# EAGLE design nrfModule (EAGLE 8.2.2)
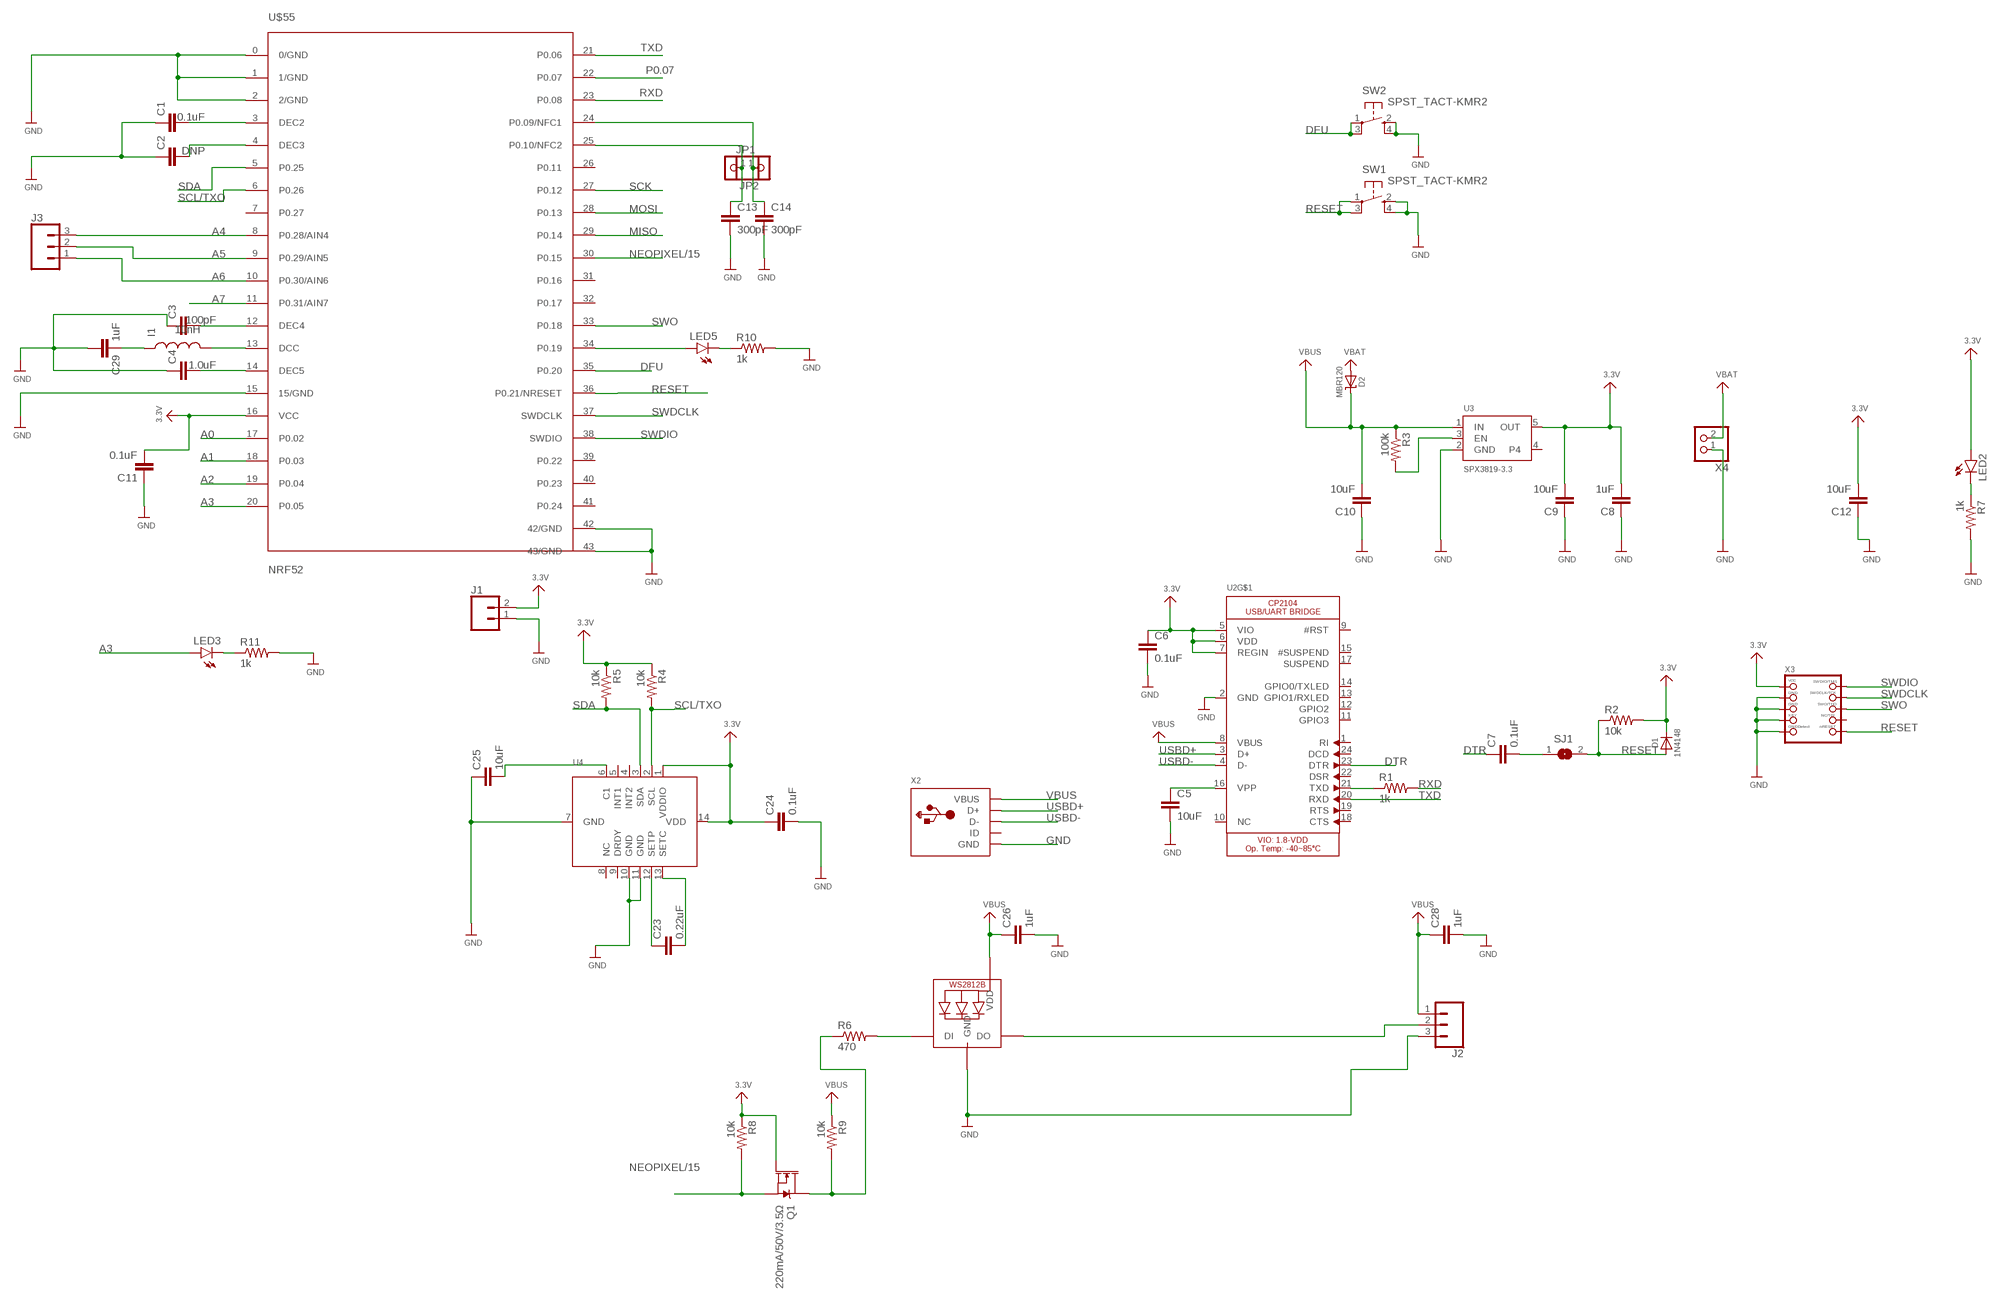
[diagram p0: schematic, sheet 1]

## Parts
C1  0.1uF  CAP  [0805]
C2  DNP  CAP  [0805]
C3  100pF  CAP  [0805]
C4  1.0uF  CAP  [0805]
C5  10uF  CAP  [0805]
C6  0.1uF  CAP  [0805]
C7  0.1uF  CAP  [0805]
C8  1uF  CAP  [0805]
C9  10uF  CAP  [0805]
C10  10uF  CAP  [0805]
C11  0.1uF  CAP  [0805]
C12  10uF  CAP  [0805]
C13  300pF  CAP  [0805]
C14  300pF  CAP  [0805]
C23  0.22uF  CAP  [0805]
C24  0.1uF  CAP  [0805]
C25  10uF  CAP  [0805]
C26  1uF  CAP  [0805]
C28  1uF  CAP  [0805]
C29  1uF  CAP  [0805]
D1  1N4148  DIODESOD-323  [SOD-323]
D2  MBR120  DIODE-SCHOTTKYSOD-123  [SOD-123]
I1  10nH  IND  [0805]
J1  CONN_02  [1X02]
J2  CONN_03  [1X03]
J3  CONN_03  [1X03]
JP1  HEADER-1X12MM  [1X01_2MM]
JP2  HEADER-1X12MM  [1X01_2MM]
LED1  WS2812B5050  [WS2812B]
LED2  LED0603  [LED-0603]
LED3  LED0603  [LED-0603]
LED5  LED0603  [LED-0603]
Q1  220mA/50V/3.5Ω  MOSFET-NCH-BSS138  [SOT23-3]
R1  1k  RES  [0805]
R2  10k  RES  [0805]
R3  100k  RES  [0805]
R4  10k  RES  [0805]
R5  10k  RES  [0805]
R6  470  RES  [0805]
R7  1k  RES  [0805]
R8  10k  RES  [0805]
R9  10k  RES  [0805]
R10  1k  RES  [0805]
R11  1k  RES  [0805]
SJ1  SOLDERJUMPERCLOSED  [SOLDERJUMPER_CLOSEDWIRE]
SW1  SPST_TACT-KMR2  [KMR2]
SW2  SPST_TACT-KMR2  [KMR2]
U2  CP2104  [QFN24_4MM_SMSC]
U3  SPX3819-3.3  VREG_SOT23-5  [SOT23-5]
U4  LSM303DLHC  [LGA14]
U$55  NRF52  [NRF52]
X2  USB_MICRO_20329_V2  [4UCONN_20329_V2]
X3  JTAG-CORTEX  [2X05_1.27MM_SMT]
X4  CON_JST_PH_2PIN  [JSTPH2]

## Nets
3.3V: C6.1 C8.2 C9.2 C11.2 C12.2 C24.1 D1.C J1.2 LED2.A Q1.1(G) R2.2 R4.1 R5.1 R8.1 U2.5(VIO) U2.6(VDD) U2.7(REGIN) U3.5(OUT) U4.1(VDDIO) U4.14(VDD) U$55.16(VCC) X3.1(VCC)
A0: U$55.17(P0.02)
A1: U$55.18(P0.03)
A2: U$55.19(P0.04)
A3: LED3.A U$55.20(P0.05)
A4: J3.3 U$55.8(P0.28/AIN4)
A5: J3.2 U$55.9(P0.29/AIN5)
A6: J3.1 U$55.10(P0.30/AIN6)
A7: U$55.11(P0.31/AIN7)
DFU: SW2.1(P) SW2.3(P1) U$55.35(P0.20)
DTR: C7.1 U2.23(DTR)
GND: C1.1 C2.1 C3.1 C4.1 C5.2 C6.2 C8.1 C9.1 C10.1 C11.1 C12.1 C13.2 C14.2 C24.2 C25.1 C26.2 C28.2 C29.2 J1.1 J2.3 LED1.3-GND(GND) R7.2 R10.2 R11.2 SW1.2(S) SW1.4(S1) SW2.2(S) SW2.4(S1) U2.2(GND) U3.2(GND) U4.7(GND) U4.10(GND) U4.11(GND) U$55.0(0/GND) U$55.1(1/GND) U$55.2(2/GND) U$55.15(15/GND) U$55.42(42/GND) U$55.43(43/GND) X2.BASE@1(GND) X2.BASE@2(GND) X2.GND X2.SPRT@1(GND) X2.SPRT@2(GND) X2.SPRT@3(GND) X2.SPRT@4(GND) X3.3(GND) X3.5(GND) X3.7(KEY) X3.9(GNDDETECT) X4.1
MISO: U$55.29(P0.14)
MOSI: U$55.28(P0.13)
N$1: LED5.A U$55.34(P0.19)
N$2: LED5.C R10.1
N$3: C2.2 U$55.4(DEC3)
N$4: C4.2 U$55.14(DEC5)
N$5: R1.1 U2.21(TXD)
N$6: C1.2 U$55.3(DEC2)
N$8: C5.1 U2.16(VPP)
N$9: C23.2 U4.13(SETC)
N$10: C13.1 JP2.1 U$55.25(P0.10/NFC2)
N$11: C7.2 SJ1.1
N$12: C23.1 U4.12(SETP)
N$13: R3.2 U3.3(EN)
N$14: C14.1 JP1.1 U$55.24(P0.09/NFC1)
N$15: LED2.C R7.1
N$16: LED3.C R11.1
N$20: Q1.3(D) R6.1 R9.2
N$21: C25.2 U4.6(C1)
N$23: J2.2 LED1.2-DOUT(DO)
N$25: LED1.4-DIN(DI) R6.2
N$26: I1.2 U$55.13(DCC)
N$27: C29.1 I1.1
N$28: C3.2 U$55.12(DEC4)
NEOPIXEL/15: Q1.2(S) R8.2 U$55.30(P0.15)
P0.07: U$55.22(P0.07)
RESET: D1.A R2.1 SJ1.2 SW1.1(P) SW1.3(P1) U$55.36(P0.21/NRESET) X3.10(NRESET)
RXD: R1.2 U$55.23(P0.08)
SCK: U$55.27(P0.12)
SCL/TXO: R4.2 U4.2(SCL) U$55.6(P0.26)
SDA: R5.2 U4.3(SDA) U$55.5(P0.25)
SWDCLK: U$55.37(SWDCLK) X3.4(SWDCLK)
SWDIO: U$55.38(SWDIO) X3.2(SWDIO)
SWO: U$55.33(P0.18) X3.6(SWO)
TXD: U2.20(RXD) U$55.21(P0.06)
USBD+: U2.3(D+) X2.D+
USBD-: U2.4(D-) X2.D-
VBAT: D2.A X4.2
VBUS: C10.2 C26.1 C28.1 D2.C J2.1 LED1.1-VDD(VDD) R3.1 R9.1 U2.8(VBUS) U3.1(IN) X2.VBUS
Unconnected: U2.1(RI) U2.9(#RST) U2.10(NC) U2.11(GPIO3) U2.12(GPIO2) U2.13(GPIO1/RXLED) U2.14(GPIO0/TXLED) U2.15(#SUSPEND) U2.17(SUSPEND) U2.18(CTS) U2.19(RTS) U2.22(DSR) U2.24(DCD) U3.4 U4.4(INT2) U4.5(INT1) U4.8(NC) U4.9(DRDY) U$55.7(P0.27) U$55.26(P0.11) U$55.31(P0.16) U$55.32(P0.17) U$55.39(P0.22) U$55.40(P0.23) U$55.41(P0.24) X2.ID X3.8(TDI)

## Power pins joined to a net without a drawn wire
TP: U2.THERM(TP)

## Library data of the parts
C1-C14 C23-C26 C28 C29 = Ilya_Teach:CAP
D1 = microbuilder:DIODE: Diode SMA Model Volts Amps Type Vf Ir Digikey # Notes SSA34-E3 40V 3A Schottky 480mV @ 3A 200uA @ 40V SSA34-E3/61TGITR-ND CDBA120-G 20V 1A Schottky 500mV @ 1A 500uA @ 20V 641-1014-6-ND REEL MBRA210 10V 2A Schottky 350mV @ 2A 700uA @ 10V MBRA210LT3 SOD-123 Model Volts Amps Type Vf Ir Order # Notes BAT54T1G 30V 200mA Schottky 800mV @ 200mA 2uA @ 25V BAT54T1GOSTR-ND B0530W 30V 500mA Schottky 430mV @ 500mA 130uA @ 30V B0530W-FDICT-ND REEL MBR120 20V 1A Schottky 340mV @ 1A MBR120VLSFT1GOSCT-ND SOD-323 Model Volts Amps Type Vf Ir Order # Notes PMEG2005EJ 20V 500mA Schottky 355mV @ 500mA 568-4110-1-ND ZLLS410 10V 570mA Schottky 380mV @ 570mA ZLLS410CT-ND 1N4148WS 75V 150mA Silicon/Simple 1V 1N4148WSFSCT-ND REEL SOD-523 Model Volts Amps Type Vf Ir Order # Notes BAT54XV2 30V 200mA Schottky 0.8V @ 100mA BAT54XV2CT-ND TB751S 30V 30mA Schottky RB751S-40TE61CT-ND SOT23-R/W (R = Solder Paste/Reflow Ovens, W = Hand-Soldering) Model Volts Amps Type Vf Ir Order # Notes BAT54FILM 40V 300mA Schottky 497-7162-1-ND POWERDI-5 Model Volts Amps Type Vf Ir Order # Notes PDS560 60V 5A Schottky 670mV @ 5A 150uA @ 60V PDS560DICT-ND
D2 = microbuilder:DIODE-SCHOTTKY
I1 = Ilya_Teach:IND
J1 = SparkFun-Connectors:CONN_02: Multi connection point. Often used as Generic Header-pin footprint for 0.1 inch spaced/style header connections On any of the 0.1 inch spaced packages, you can populate with these: Break Away Headers - Straight <https://www.sparkfun.com/products/116> (PRT-00116) Break Away Male Headers - Right Angle <https://www.sparkfun.com/products/553> (PRT-00553) Female Headers <https://www.sparkfun.com/products/115> (PRT-00115) Break Away Headers - Machine Pin <https://www.sparkfun.com/products/117> (PRT-00117) Break Away Female Headers - Swiss Machine Pin <https://www.sparkfun.com/products/743> (PRT-00743) For SCREWTERMINALS and SPRING TERMINALS visit here: Screw Terimnals on SparkFun.com <https://www.sparkfun.com/search/results?term=Screw+Terminals> (5mm/3.5mm/2.54mm spacing) This device is also useful as a general connection point to wire up your design to another part of your project. Our various solder wires solder well into these plated through hole pads. Hook-Up Wire - Assortment (Stranded, 22 AWG) <https://www.sparkfun.com/products/11375> (PRT-11375) Hook-Up Wire - Assortment (Solid Core, 22 AWG) <https://www.sparkfun.com/products/11367> (PRT-11367) View the entire wire category on our website here <https://www.sparkfun.com/categories/141> Special notes: Molex polarized connector foot print use with: PRT-08233 with associated crimp pins and housings. 2.54_SCREWTERM for use with PRT-10571. 3.5mm Screw Terminal footprints for PRT-08084 5mm Screw Terminal footprints for use with PRT-08432
J2 J3 = SparkFun-Connectors:CONN_03: Multi connection point. Often used as Generic Header-pin footprint for 0.1 inch spaced/style header connections On any of the 0.1 inch spaced packages, you can populate with these: Break Away Headers - Straight <https://www.sparkfun.com/products/116> (PRT-00116) Break Away Male Headers - Right Angle <https://www.sparkfun.com/products/553> (PRT-00553) Female Headers <https://www.sparkfun.com/products/115> (PRT-00115) Break Away Headers - Machine Pin <https://www.sparkfun.com/products/117> (PRT-00117) Break Away Female Headers - Swiss Machine Pin <https://www.sparkfun.com/products/743> (PRT-00743) Stackable Header - 3 Pin (Female, 0.1") <https://www.sparkfun.com/products/13875> (PRT-13875) For SCREWTERMINALS and SPRING TERMINALS visit here: Screw Terimnals on SparkFun.com <https://www.sparkfun.com/search/results?term=Screw+Terminals> (5mm/3.5mm/2.54mm spacing) This device is also useful as a general connection point to wire up your design to another part of your project. Our various solder wires solder well into these plated through hole pads. Hook-Up Wire - Assortment (Stranded, 22 AWG) <https://www.sparkfun.com/products/11375> (PRT-11375) Hook-Up Wire - Assortment (Solid Core, 22 AWG) <https://www.sparkfun.com/products/11367> (PRT-11367) View the entire wire category on our website here <https://www.sparkfun.com/categories/141> Special notes: Molex polarized connector foot print use with SKU : PRT-08232 with associated crimp pins and housings.
JP1 JP2 = microbuilder:HEADER-1X1: PIN HEADER
LED1 = adafruit:WS2812B
LED2 LED3 LED5 = Ilya_Teach:LED: LEDs Standard schematic elements and footprints for 5mm, 3mm, 1206, and 0603 sized LEDs. 5mm - Spark Fun Electronics SKU : COM-00529 (and others)
Q1 = SparkFun-DiscreteSemi:MOSFET-NCH: N-channel MOSFETs Voltage controlled devices that allow control of high current outputs. SparkFun Products: SparkFun OpenScale <https://www.sparkfun.com/products/13261> SparkFun Digital Sandbox <https://www.sparkfun.com/products/12651> SparkFun Monster Moto Shield <https://www.sparkfun.com/products/10182> SparkFun MOSFET Power Controller <https://www.sparkfun.com/products/11214>; PROD_ID: TRANS-00830
R1-R11 = Ilya_Teach:RES
SJ1 = microbuilder:SOLDERJUMPER: SMD Solder JUMPER Solder the two pads together to create a connection, or remove the solder to break it. REFLOW - Use this footprint for solder paste and reflow ovens. WAVE - Use this footprint for hand-soldering (larger pads). CLOSED - Has a trace between the two pads to ensure it is closed by default. The trace needs to be cut to disable the jumper, and can be closed again by creating a solder bridge between the two pads.
SW1 SW2 = adafruit:SPST_TACT: SMT 6mm switch, EVQQ2 series http://www.ladyada.net/library/eagle
U2 = microbuilder:CP2104: CP2104 - USB to UART Bridge VDD Output: 3.45V
U3 = microbuilder:VREG_SOT23-5: SOT23-5 Fixed Voltage Regulators Part Current Out V Out V In V Dropout ?JA (°C/W) TJ (°C) Digikey Part No. ADP121 150mA 3.3V 3.4-5.5V 0.09V @ 150mA -- -- ADP121-AUJZ33R7CT-ND ADP121 150mA 3.0V 3.1-5.5V 0.09V @ 150mA -- -- ADP121-AUJZ30R7CT-ND ADP122 300mA 3.3V 3.4-5.5V 0.085V @ 300mA -- -- ADP122AUJZ-3.3-R7CT-ND ADP1712 300mA 3.3V 3.5-5.5V 0.17V @ 300mA -- -- ADP1712AUJZ-3.3-R7TR-ND AP7311 (Low Cost) 150mA 3.3V 3.5-6V 0.15V @ 150mA -- -- AP7311-33WG-7DICT-ND LD39015M18R 150mA 1.8V 1.9V-5.5V 0.08V @ 100mA -- -- 497-6977-1-ND LP2985A-33DBVR 150mA 3.3V 3.3-16V 0.28V @ 150mA 206 150 296-18479-1-ND MCP1824T-3302E/OT 300mA 3.3V 3.5V-6V 0.2V @ 300mA -- -- MCP1824T-3302E/OTCT-ND MIC5205-2.5YM5 TR 150mA 2.5V 2.7-16V 0.165V @ 150mA -- -- 576-1257-2-ND MIC5205-3.0YM5 TR 150mA 3.0V 3.2V-16V 0.165V @ 150mA -- -- 576-1258-2-ND MIC5205-3.3YM5 TR 150mA 3.3V 3.5V-16V 0.165V @ 150mA -- -- 576-1259-2-ND TPS780330220 150mA 3.3V+2.2V 3.6-5.5V 250mV Max -- -- 296-23332-1-ND TDA3663/N1,135 100mA 3.3V 3.5-45V 0.18V @ 50mA -- -- 568-5343-1-ND Max operating temp can be calculated using ?JA, TJ (max junction temperature), and power in watts. Set the "Maximum Ambient Temperature" until it reaches TJ ("Max Junction Temperature"), which is the absolute limit for safe use of the regulator: Heat Sink Temperature Calculator <http://www.daycounter.com/Calculators/Heat-Sink-Temperature-Calculator.phtml> For example, With 12V source into a 3.3V LP2985 and a 30mA load, we are dissipating (12V-3.3V) * 0.03A = 0.261W. With a ?JA of 206 °C/W, a TJ of 150°C, and 261mW we can safely use the chip without a heat sink up to 75°C (=147.1°C Junction Temperature).
U4 = untitled:LSM303DLHC: LSM303DLHC 3-Axis I2C Accelerometer and 3-Axis Magnetometer VDD: 2.2-3.6V VDDIO: 1.8-VDD Magnetic Range: +/-1.3 to +/-8.1 gauss Accel Range: +/-2/4/8/16 g Temp: -40 - 85°C
U$55 = Ilya_Teach:NRF52
X2 = microbuilder:USB: USB Connectors USBMINIB - Surface Mount Female Mini-B USB Connector 4UConnector: 06564
X3 = microbuilder:JTAG-CORTEX: Serial Wire (SW-DP) Connector Standard 0.05" 10-pin connector is for use with the Cortex M and Cortex A SWD (serial wire debugger) interface (SW-DP) Connectors 2x05_1.27MM_SMT - Inexpensive surface-mount header with bare pins, compatible with standard 10-pin SWD cables (4UCON: 16846) 2x05_1.27MM_BOX_NOPOSTS - Polarised surface-mount box (4UCON with caps: 19735, without caps: 15117 2x05_1.27MM_BOX_POSTS - Polarised surface-mount box with mounting holes (4UCON: 20317) Pinout: http://infocenter.arm.com/help/topic/com.arm.doc.faqs/attached/13634/cortex_debug_connectors.pdf http://www.keil.com/peripherals/coresight/connectors.asp
X4 = microbuilder:CON_JST_PH_2PIN: JST 2-Pin Right-Angle Connector PH-Series - 4UConnector: 17311 SH-Series - 4UConnector: 07278

## Board
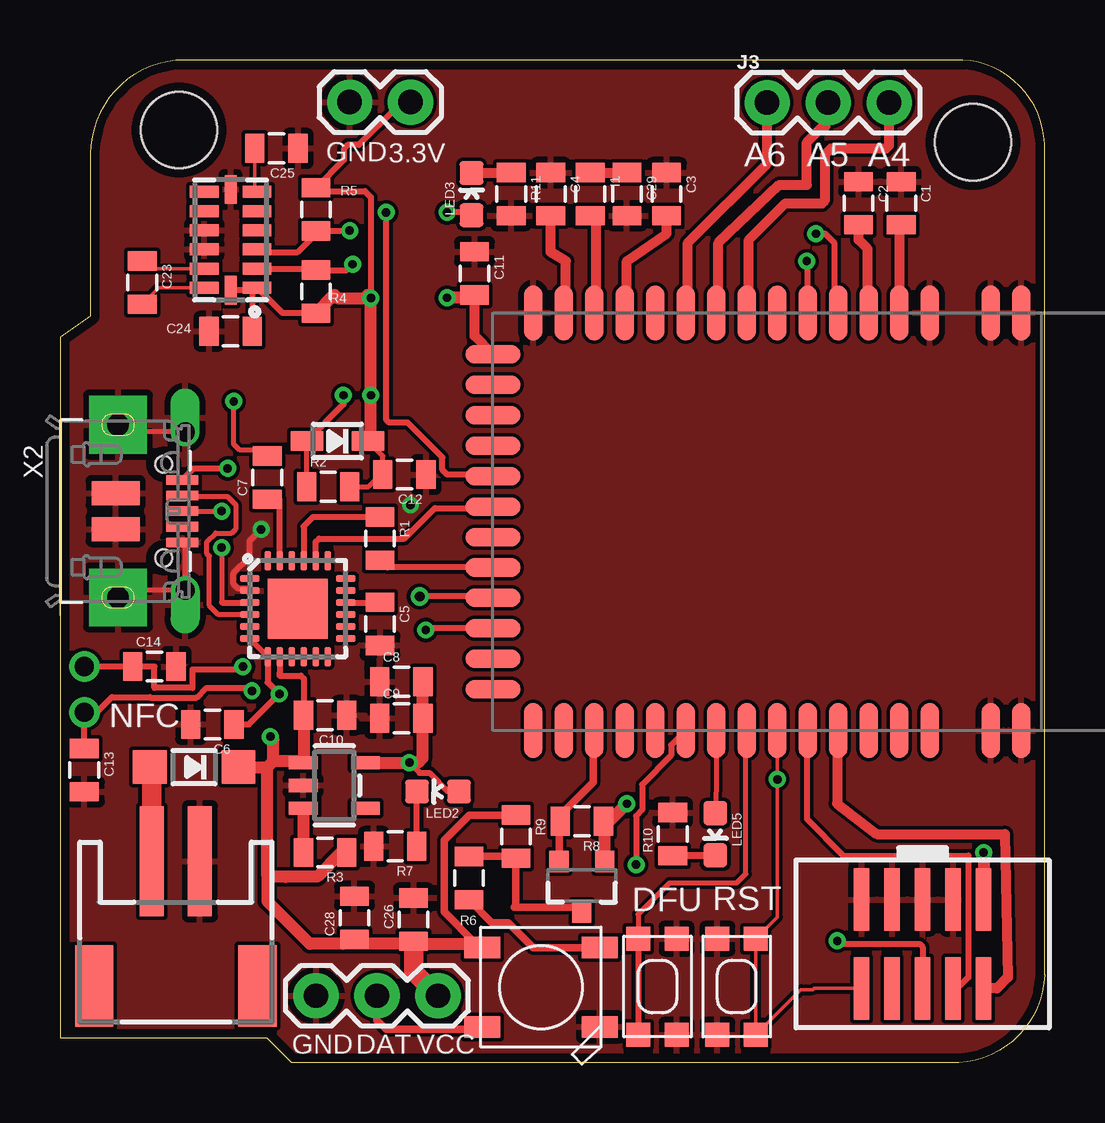
[diagram p1: board, top side]
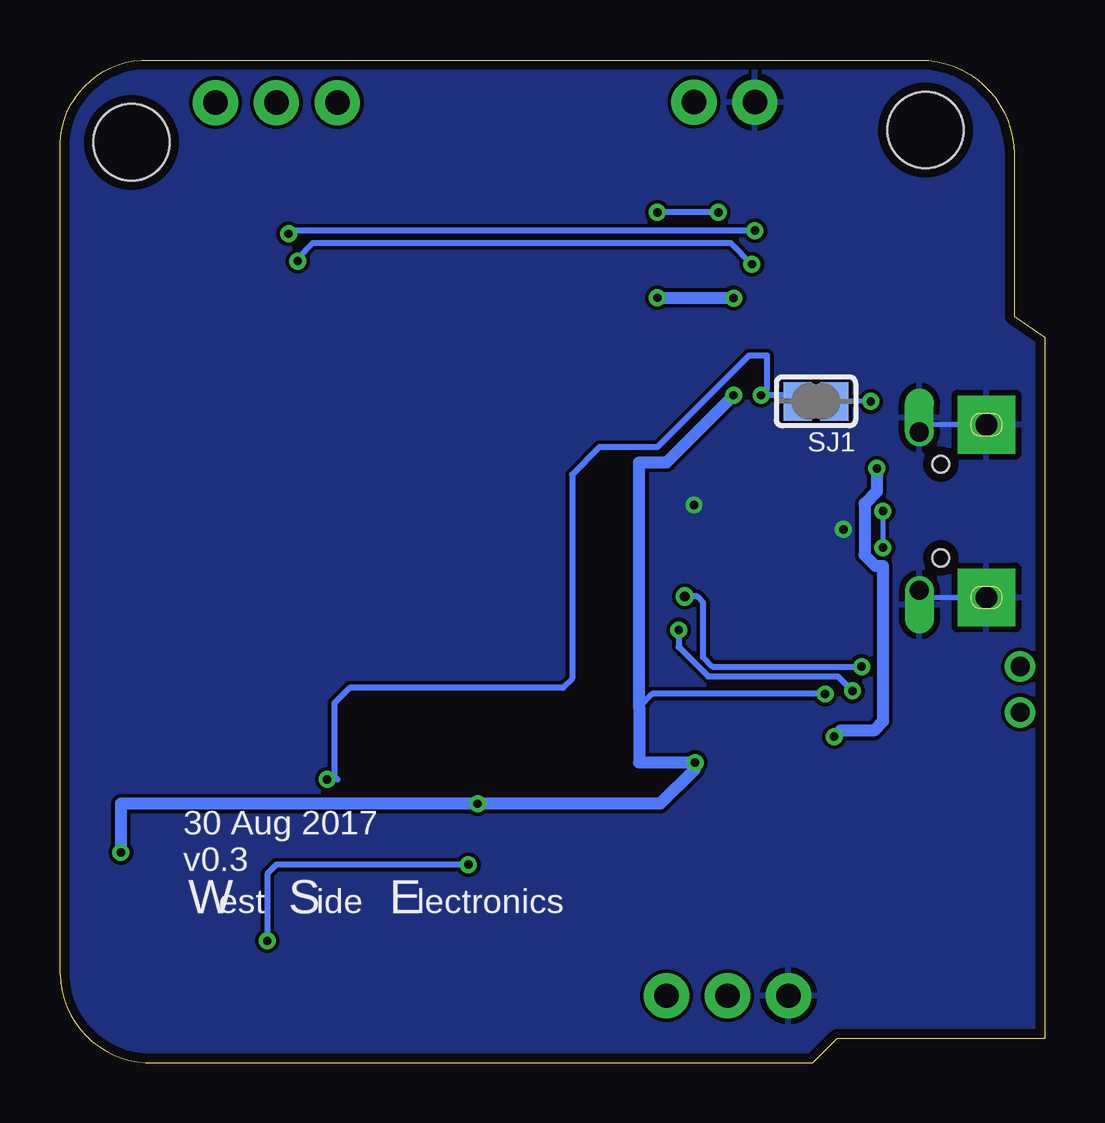
[diagram p2: board, bottom side, seen from below]

Size 41.02 x 41.78 mm. Coordinates in mm from the lower left corner, seen from the top.
Outline: 37.1,0 9.65,0 8.64,1.02 0,1.02 0,30.23 1.27,31.11 1.27,37.87 arc-90 5.19,41.78 37.28,41.78 arc-90 41.02,38.29 41.02,3.66 arc-90 37.1,0
Copper layers (1*16): Top 0.0356mm / dielectric 1.5011mm / Bottom 0.0356mm
Design rules "LaenPCBOrder": minimum track width 6mil, minimum drill 13mil, track to track 6mil, track to pad 6mil, pad to pad 6mil, via to via 6mil, smd to smd 6mil, copper to edge 15mil, drill to drill 6mil, minimum pad ring 7mil, minimum via ring 7mil, stop-mask expansion 3mil, vias tented up to drill 0mil, thermal gap 10mil
Holes 3.17 mm at 4.95,38.86 38.05,38.35

### Footprints (pad centres in the part's own frame; a part is rotated, then mirrored left to right if it is on the bottom)
0805 = smd 0.8 x 1.2: 1 -0.9,0; 2 0.9,0
SOD-323 = smd 1.35 x 0.8: A 1.27,0; C -1.27,0
SOD-123 = smd 1.4 x 1.4: A 1.85,0; C -1.85,0
1X02 = drill 1.016 pad 1.88: 1 0,0; 2 2.54,0
1X03 = drill 1.016 pad 1.88: 1 0,0; 2 2.54,0; 3 5.08,0
1X01_2MM = drill 0.8 pad 1.27: 1 0,0
WS2812B = smd 1.5 x 0.9: 1-VDD 2.45,-1.65; 2-DOUT 2.45,1.65; 3-GND -2.45,1.65; 4-DIN -2.45,-1.65
LED-0603 = smd 1 x 1: A 0,-0.877; C 0,0.877
SOT23-3 = smd 0.8 x 0.9: 1 -0.95,-1; 2 0.95,-1; 3 0,1.1
SOLDERJUMPER_CLOSEDWIRE = smd 1.168 x 1.6: 1 -0.762,0; 2 0.762,0 | smd 0.635 x 0.203: WIRE 0,0
KMR2 = smd 1 x 1: 1 2,0.8; 2 2,-0.8; 3 -2,0.8; 4 -2,-0.8
QFN24_4MM_SMSC = smd 0.8 x 0.28: 1 -2,1.25; 2 -2,0.75; 3 -2,0.25; 4 -2,-0.25; 5 -2,-0.75; 6 -2,-1.25; 13 2,-1.25; 14 2,-0.75; 15 2,-0.25; 16 2,0.25; 17 2,0.75; 18 2,1.25 | smd 0.28 x 0.8: 7 -1.25,-2; 8 -0.75,-2; 9 -0.25,-2; 10 0.25,-2; 11 0.75,-2; 12 1.25,-2; 19 1.25,2; 20 0.75,2; 21 0.25,2; 22 -0.25,2; 23 -0.75,2; 24 -1.25,2 | smd 2.5 x 2.5: THERM 0,0
SOT23-5 = smd 0.55 x 1.2: 1 -0.95,-1.3; 2 0,-1.3; 3 0.95,-1.3; 4 0.95,1.3; 5 -0.95,1.3
LGA14 = smd 0.5 x 1.2: 1 2,1.1; 2 1.2,1.1; 3 0.4,1.1; 4 -0.4,1.1; 5 -1.2,1.1; 6 -2,1.1; 8 -2,-1.1; 9 -1.2,-1.1; 10 -0.4,-1.1; 11 0.4,-1.1; 12 1.2,-1.1; 13 2,-1.1 | smd 1.2 x 0.5: 7 -2.1,0; 14 2.1,0
NRF52 = smd 0.762 x 2.286: 0 22.014,17.399; 1 20.744,17.399; 2 18.204,17.399; 3 16.934,17.399; 4 15.664,17.399; 5 14.394,17.399; 6 13.124,17.399; 7 11.854,17.399; 8 10.584,17.399; 9 9.314,17.399; 10 8.044,17.399; 11 6.774,17.399; 12 5.504,17.399; 13 4.234,17.399; 14 2.964,17.399; 15 1.694,17.399; 28 1.694,0; 29 2.964,0; 30 4.234,0; 31 5.504,0; 32 6.774,0; 33 8.044,0; 34 9.314,0; 35 10.584,0; 36 11.854,0; 37 13.124,0; 38 14.394,0; 39 15.664,0; 40 16.934,0; 41 18.204,0; 42 20.744,0; 43 22.014,0 | smd 2.286 x 0.762: 16 0,15.684; 17 0,14.415; 18 0,13.145; 19 0,11.874; 20 0,10.604; 21 0,9.335; 22 0,8.065; 23 0,6.795; 24 0,5.524; 25 0,4.255; 26 0,2.985; 27 0,1.714
4UCONN_20329_V2 = smd 1 x 2: BASE@1 -0.75,-2; BASE@2 0.75,-2 | smd 0.4 x 1.35: D+ 0,0.775; D- -0.65,0.775; GND 1.3,0.775; ID 0.65,0.775; VBUS -1.3,0.775 | drill 0.8 pad 1.143 offset: SPRT@1 -3.3,0.9; SPRT@2 3.3,0.9 | drill 0.9 pad 2.413 square: SPRT@3 -3.6,-1.9; SPRT@4 3.6,-1.9 | hole 0.7: -1.95,0; 1.95,0
2X05_1.27MM_SMT = smd 0.65 x 2.6: 1 -2.54,-1.85; 2 -2.54,1.85; 3 -1.27,-1.85; 4 -1.27,1.85; 5 0,-1.85; 6 0,1.85; 7 1.27,-1.85; 8 1.27,1.85; 9 2.54,-1.85; 10 2.54,1.85
JSTPH2 = smd 1 x 4.6: 1 -1,-3.7; 2 1,-3.7 | smd 1.6 x 3.4: NC1 -3.4,1.5; NC2 3.4,1.5

### Placement (x,y rotation side)
C1  35.05,35.81 270 top
C2  33.27,35.81 270 top
C3  25.27,36.2 270 top
C4  20.45,36.2 270 top
C5  13.34,18.29 270 top
C6  6.35,14.1 180 top
C7  8.64,24.38 90 top
C8  14.22,15.87 0 top
C9  14.22,14.35 0 top
C10  11.05,14.48 180 top
C11  17.27,32.89 270 top
C12  14.35,24.51 180 top
C13  1.02,12.19 270 top
C14  3.94,16.51 0 top
C23  3.43,32.51 270 top
C24  7.11,30.48 180 top
C25  9.02,38.1 180 top
C26  14.73,5.97 90 top
C28  12.27,6.05 90 top
C29  23.62,36.2 270 top
D1  11.56,25.91 180 top
D2  5.59,12.32 180 top
I1  22.1,36.2 270 top
J1  12.06,40.03 0 top
J2  15.75,2.79 180 top
J3  29.46,40 0 top
JP1  1.02,16.51 0 top
JP2  1.02,14.6 0 top
LED1  20.04,3.15 180 top
LED2  15.75,11.3 90 top
LED3  17.15,36.2 0 top
LED5  27.3,9.53 180 top
Q1  21.74,7.39 180 top
R1  13.34,21.84 270 top
R2  11.18,24 0 top
R3  11.05,8.76 180 top
R4  10.67,32.13 90 top
R5  10.67,35.56 270 top
R6  17.04,7.7 270 top
R7  13.97,9.02 180 top
R8  21.74,10.06 180 top
R9  19,9.42 270 top
R10  25.53,9.53 90 top
R11  18.8,36.2 270 top
SJ1  9.52,27.56 180 bottom
SW1  28.19,3.17 270 top
SW2  24.89,3.17 90 top
U2  9.91,18.92 0 top
U3  11.43,11.56 270 top
U4  7.11,34.29 270 top
U$55  18.03,13.84 0 top
X2  4.32,22.99 270 top
X3  35.94,4.95 180 top
X4  4.83,4.7 180 top

### Tracks (layer width: path | path; a pad name or v marks a point on that pad's centre or on a via)
3.3V  (via drill 0.35)
  Top 0.203: U2.7 U2.6 U2.5 | 13.45,24.6 C12.2 | 13.45,24.6 13.45,25.28 D1.C | R2.2 12.86,24 13.45,24.6
  Top 0.254: J1.2 13.98,39.78 12.45,38.24 11.99,38.24 11.83,38.08 11.83,37.62 R5.1 10.81,36.32 12.7,36.32 12.95,36.07 v12.95,31.86 | U4.1 8.01,32.09 C24.1 | U4.1 8.11,32.19 U4.14 | U4.1 9.27,31.23 R4.1 | 14.35,12.51 v14.56,12.51 14.98,12.08 15.4,12.08 16.18,11.3 LED2.A | U2.7 8.66,15.85 v9.14,15.37 7.87,14.1 C6.1
  Top 0.305: 22.9,8.6 Q1.1
  Top 0.406: U$55.16 17.27,30.29 C11.2
  Top 0.508: 15.12,14.66 C8.2 | 15.12,14.66 C9.2 | U3.5 14.35,12.51 | v14.56,12.51 14.92,12.51 15.11,12.7 15.11,14.65 15.12,14.66 | v38.48,8.76 X3.1 | Q1.1 22.69,10.01 R8.1 22.88,10.06 v23.62,10.79 | D1.C 12.95,26.03 v12.95,27.81 v12.95,31.86 | R4.1 11.43,31.99 11.56,31.86 v12.95,31.86 | v12.95,31.86 12.82,31.99 | C11.2 17.16,31.88 v16.13,31.88
  Bottom 0.254: v9.14,15.37 16.34,15.37 16.89,14.81
  Bottom 0.508: v38.48,8.76 38.48,10.79 v23.62,10.79 16,10.79 14.56,12.24 v14.56,12.51 16.89,12.51 16.89,14.81 16.89,25.02 15.75,25.02 v12.95,27.81 | v16.13,31.88 12.83,31.88 12.84,31.86 v12.95,31.86
A3  (via drill 0.35)
  Top 0.254: U$55.20 17.97,24.51 16.13,24.51 15.93,24.71 15.93,25.23 14.49,26.67 13.72,26.67 13.59,26.8 v13.59,35.43 | LED3.A 17.03,35.43 v16.13,35.43
  Bottom 0.254: v13.59,35.43 v16.13,35.43
A4
  Top 0.406: U$55.8 28.7,31.33 28.7,34.29 30.23,35.81 31.75,35.81 31.88,35.94 31.88,37.85 32.13,38.1 34.42,38.1 34.54,38.23 J3.3
A5
  Top 0.406: U$55.9 27.43,31.41 27.43,34.16 29.97,36.58 31.12,36.58 31.12,38.35 31.75,38.99 31.88,38.99 31.88,39.88 J3.2
A6
  Top 0.406: U$55.10 26.16,31.33 26.16,34.16 29.46,37.46 J3.1
DFU
  Top 0.203: SW2.1 24.09,6.19 25.4,7.49 28.19,7.49 28.57,7.87 28.57,13.8 U$55.35
  Top 0.254: SW2.1 SW2.3
DTR
  Top 0.254: U2.23 9.16,23.47 C7.1
GND  (via drill 0.35)
  Top 0.203: X2.SPRT@2 3.55,19.69 | X2.SPRT@1 3.55,26.29
  Top 0.254: U2.2 7.82,19.75 7.43,19.75 7.23,19.96 7.23,20.39 7.91,21.07 7.91,21.75 v8.38,22.22 | X2.GND 5.22,21.56 X2.SPRT@2
  Bottom 0.203: X2.SPRT@3 4.92,26.59 X2.SPRT@1 | X2.SPRT@4 4.92,19.39 X2.SPRT@2
  other vias: 14.6,23.24
  pour Bottom: -0.89,42.67 38.48,41.78 41.02,41.78 41.02,41.4 40.89,39.37 40.89,31.75 40.77,31.5 41,14.88 41.05,13.69 41.05,13.41 41.02,12.83 40.77,3.05 41.27,0 26.8,-0.13 -0.89,-0.63
  pour Top: -1.02,42.67 38.61,41.78 41.02,41.78 40.89,39.37 40.89,32.77 41.15,32.13 41.02,31.11 40.77,30.86 41.27,17.27 41.15,14.35 41.07,13.41 41.27,0 -0.64,-0.76
N$1
  Top 0.203: U$55.34 27.35,11.59 LED5.A
N$2
  Top 0.305: LED5.C R10.1
N$3
  Top 0.406: U$55.4 33.65,31.24 33.65,33.91 33.27,34.29 C2.2
N$4
  Top 0.406: U$55.14 21.08,31.33 21.08,33.4 20.45,33.78 C4.2
N$5
  Top 0.254: R1.1 13.32,22.73 10.54,22.73 10.16,22.35 U2.21
N$6
  Top 0.406: C1.2 34.97,34.83 U$55.3
N$8
  Top 0.254: U2.16 13.32,19.17 C5.1
N$9
  Top 0.152: C23.2 4.11,32.29 U4.13
N$10  (via drill 0.35)
  Top 0.254: C13.1 JP2.1 1.52,14.6 2.16,15.24 3.74,15.24 3.77,15.21 5.69,15.21 6.1,15.62 7.87,15.62 v8,15.49 | U$55.25 15.3,18.1 v15.24,18.03
  Bottom 0.254: v8,15.49 8.61,16.1 14.01,16.1 15.24,17.33 v15.24,18.03
N$11  (via drill 0.35)
  Top 0.203: C7.2 8.64,25.53 7.49,25.53 7.24,25.78 v7.24,27.56
  Bottom 0.203: v7.24,27.56 SJ1.1
N$12
  Top 0.152: C23.1 3.75,33.09 U4.12
N$13
  Top 0.508: U3.3 10.13,9.19 R3.2
N$14  (via drill 0.35, 0.41)
  Top 0.254: JP1.1 C14.1 3.94,16.51 3.94,15.62 5.52,15.62 5.52,16.38 7.49,16.38 v7.62,16.51 | U$55.24 17.97,19.43 v14.99,19.43
  Bottom 0.254: v14.99,19.43 14.48,19.43 14.22,19.18 14.22,16.89 13.84,16.51 v7.62,16.51
N$15
  Top 0.254: R7.1 LED2.C
N$16
  Top 0.406: R11.1 18.77,37.07 LED3.C
N$20
  Top 0.305: Q1.3 21.56,6.48 18.92,6.48 19,6.55 R9.2 18.93,8.6 R6.1
N$21
  Top 0.152: C25.2 8.12,36.38 U4.6
N$23
  Top 0.305: LED1.2-DOUT 16.85,1.4 13.59,1.4 13.21,1.78 J2.2
N$25
  Top 0.305: R6.2 18,5.84 18.67,5.84 19.71,4.8 LED1.4-DIN
N$26
  Top 0.406: U$55.13 22.35,31.33 22.35,35.18 I1.2
N$27
  Top 0.406: I1.1 C29.1
N$28
  Top 0.406: U$55.12 23.62,31.33 23.62,33.4 25.27,34.54 C3.2
NEOPIXEL/15
  Top 0.305: U$55.30 22.23,13.8 22.23,11.68 21.1,10.55 R8.2 20.79,9.75 Q1.2
RESET  (via drill 0.35)
  Top 0.152: X3.10 31.42,3.1 31.37,3.05 30.87,3.05 SW1.1 SW1.3 29.89,6.07 v29.89,11.81 U$55.36
  Top 0.203: D1.A 10.29,24.01 R2.1
  Top 0.254: D1.A 11.81,27.43 v11.81,27.81
  Bottom 0.254: v29.89,11.81 29.46,11.81 29.59,11.94 29.59,14.99 28.96,15.62 20.07,15.62 19.68,16 19.68,24.51 18.54,25.65 16.13,25.65 12.32,29.46 11.56,29.46 11.56,28.07 v11.81,27.81 10.54,27.81 SJ1.2
RXD
  Top 0.254: U$55.23 13.64,20.64 R1.2
SCL/TXO  (via drill 0.35)
  Top 0.254: U4.2 10.61,33.09 R4.2 11.95,33.03 v12.19,33.27 | U$55.6 31.16,33.36 v31.12,33.4
  Bottom 0.254: v31.12,33.4 31.12,33.53 30.48,34.16 13.08,34.16 v12.19,33.27
SDA  (via drill 0.35)
  Top 0.254: U4.3 8.32,33.78 9.91,33.78 10.67,34.54 R5.2 12.05,34.66 v12.06,34.67 | v31.5,34.54 31.88,34.54 32.26,34.16 32.26,31.41 U$55.5
  Bottom 0.254: v12.06,34.67 31.5,34.67 31.62,34.54 v31.5,34.54
SWDCLK
  Top 0.254: U$55.37 31.12,13.8 31.12,10.16 32.64,8.64 37.85,8.64 37.85,3.56 37.39,3.1 X3.4
SWDIO
  Top 0.406: U$55.38 32.38,13.8 32.38,10.79 34.04,9.53 39.37,9.53 39.5,3.56 39.04,3.1 X3.2
SWO  (via drill 0.35)
  Top 0.152: X3.6 36.07,3.23 | 26.04,13.8 U$55.33
  Top 0.254: U$55.33 25.47,13.23 25.47,12.81 24.25,11.59 24.25,10.53 24,10.28 v24,8.26 | v32.38,5.08 32.51,4.95 35.81,4.95 35.94,4.83 X3.6
  Bottom 0.254: v24,8.26 32,8.26 32.38,7.87 v32.38,5.08
TXD
  Top 0.254: U2.20 10.66,21.7 10.79,21.84 14.35,21.84 15.62,23.11 17.97,23.11 U$55.21
USBD+  (via drill 0.35)
  Top 0.203: X2.D+ v6.73,22.99 | v6.73,21.46 6.73,19.2 6.76,19.17
  Top 0.254: 6.76,19.17 U2.3
  Bottom 0.203: v6.73,22.99 v6.73,21.46
USBD-
  Top 0.203: U2.4 6.6,18.67 6.22,19.05 6.22,21.11 6.12,21.21 6.12,21.71 6.48,22.07 7.15,22.07 7.34,22.25 7.34,23.24 6.98,23.59 5.14,23.59 X2.D-
VBAT
  Top 0.813: X4.2 3.83,12.23 D2.A
VBUS  (via drill 0.35)
  Top 0.254: U2.8 9.16,16.24 9.14,16.13 10.03,16.13 10.16,16 10.16,14.49 C10.2 | X2.VBUS 5.57,24.77 v6.98,24.77 | C28.1 12.08,4.95 11.8,4.95 | C26.1 14.74,5.06 14.74,4.95
  Top 0.305: LED1.1-VDD 17.5,4.8 17.35,4.95 16,6.3 16,9.27 17.05,10.32 R9.1
  Top 0.508: D2.C 8.64,12.32 | 8.64,12.32 8.89,12.57 | 10.02,12.57 8.89,12.57 | 10.02,12.57 10.06,12.57 U3.1 | C10.2 10.15,12.7 10.02,12.57 | 8.64,7.77 8.64,12.32 | 8.64,7.77 8.64,6.73 10.41,4.95 11.8,4.95 14.74,4.95 17.35,4.95 | 8.89,12.57 8.89,13.46 v8.76,13.59 | R3.1 11.72,8.76 10.72,7.76 9.41,7.76 9.4,7.75 8.66,7.75 8.64,7.77
  Top 0.813: J2.1 14.74,3.8 14.74,4.95
  Bottom 0.508: 8.7,13.53 v8.76,13.59 8.51,13.84 7.11,13.84 6.73,14.22 6.73,20.7 7.04,20.7 7.49,21.15 7.49,23.3 6.98,23.81 v6.98,24.77

### Text on the board
tPlace: GND | 3.3V | A6 | A5 | A4 | NFC | DFU | RST | GND | DAT | VCC
bNames: 30 Aug 2017 / v0.3 | lectronics | E | ide | S | est | W